# Altium schematic sheet main.SchDoc
size A4; SheetNumber: 1; SheetTotal: 2
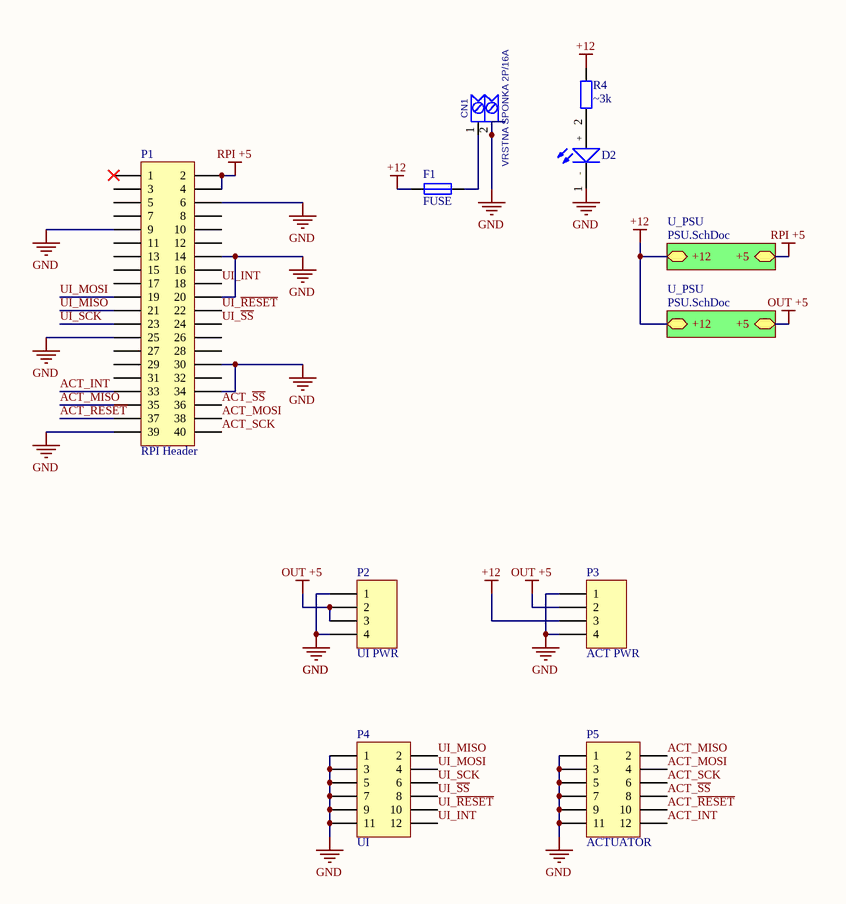
[diagram p0: main.SchDoc]

## Parts
CN1  VRSTNA SPONKA 2P/16A  [VRSTNA SPONKA 2P/16A]
D2  LED  [LED1608_0603I_L]  (value not drawn)
F1  FUSE  [R1005_0402i_M]
P1  RPI Header  [HDR2X20]
P2  UI PWR  [HDR1X4]
P3  ACT PWR  [HDR1X4]
P4  UI  [1.27mm headet tht]
P5  ACTUATOR  [1.27mm headet tht]
R4  ~3k  [R1005_0402i_L]

## Sub-sheets
U_PSU = PSU.SchDoc: +12 (bidir), +5 (bidir)
U_PSU = PSU.SchDoc: +12 (bidir), +5 (bidir)

## Nets
+12: F1.1 P3.3 R4.1 ; sheet U_PSU/+12, sheet U_PSU/+12
GND: CN1.2 D2.1(-) P1.6 P1.9 P1.14 P1.20 P1.25 P1.30 P1.34 P1.39 P2.1 P2.4 P3.1 P3.4 P4.1 P4.3 P4.5 P4.7 P4.9 P4.11 P5.1 P5.3 P5.5 P5.7 P5.9 P5.11
OUT +5: P2.2 P2.3 P3.2 ; sheet U_PSU/+5
RPI +5: P1.2 P1.4 ; sheet U_PSU/+5
ACT_INT: P1.33 P5.12
ACT_MISO: P1.35 P5.2
ACT_MOSI: P1.38 P5.4
ACT_~{RESET}: P1.37 P5.10
ACT_~{SS}: P1.36 P5.8
ACT_SCK: P1.40 P5.6
UI_INT: P1.18 P4.12
UI_MISO: P1.21 P4.2
UI_MOSI: P1.19 P4.4
UI_~{RESET}: P1.22 P4.10
UI_~{SS}: P1.24 P4.8
UI_SCK: P1.23 P4.6
NetCN1_1: CN1.1 F1.2
NetD2_2: D2.2(+) R4.2

Not connected (* = marked no-connect by the designer): P1 1* 3 5 7 8 10 11 12 13 15 16 17 26 27 28 29 31 32

## Library data of the parts
P1 = Header 20X2: Header, 20-Pin, Dual row; LatestRevisionDate: 17-Jul-2002; LatestRevisionNote: Re-released for DXP Platform.; Publisher: Altium Limited
P2 P3 = Header 4: Header, 4-Pin; LatestRevisionDate: 17-Jul-2002; LatestRevisionNote: Re-released for DXP Platform.; Publisher: Altium Limited
P4 P5 = Header 6X2: Header, 6-Pin, Dual row; LatestRevisionDate: 17-Jul-2002; LatestRevisionNote: Re-released for DXP Platform.; Publisher: Altium Limited
R4 = R
CN1 = VRSTNA SPONKA 2P/16A: Value: *